# EAGLE design pomodoro_pcb (EAGLE 9.6.2)
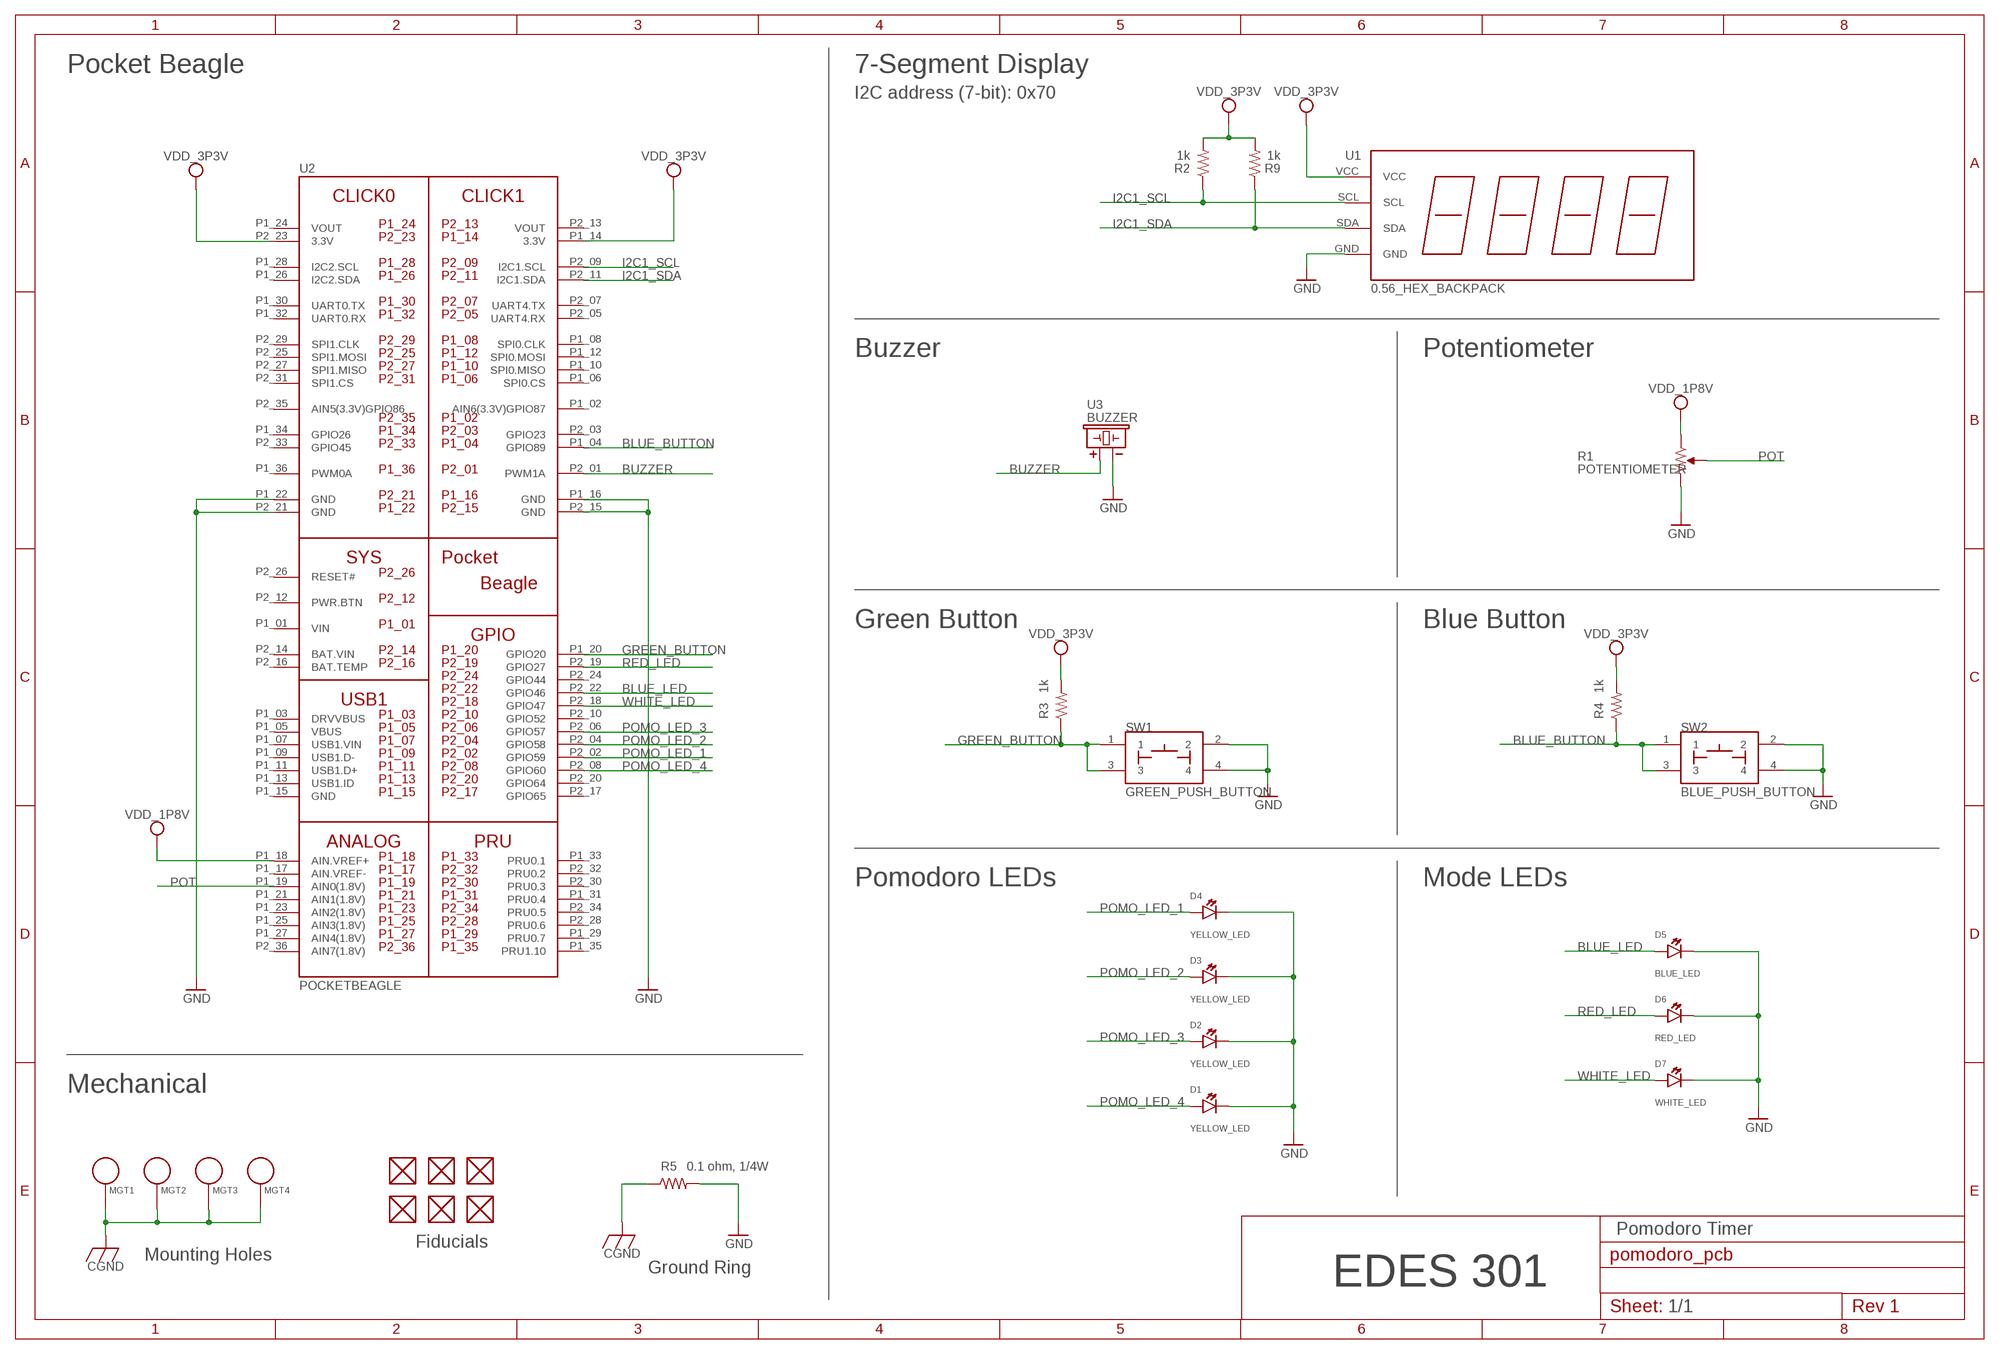
[diagram p0: schematic, sheet 1]

## Parts
D1  YELLOW_LED  LED  [EIA-STD]
D2  YELLOW_LED  LED  [EIA-STD]
D3  YELLOW_LED  LED  [EIA-STD]
D4  YELLOW_LED  LED  [EIA-STD]
D5  BLUE_LED  LED  [EIA-STD]
D6  RED_LED  LED  [EIA-STD]
D7  WHITE_LED  LED  [EIA-STD]
FUD1  FIDUCIAL  [FIDUCIAL_40MIL]
FUD2  FIDUCIAL  [FIDUCIAL_40MIL]
FUD3  FIDUCIAL  [FIDUCIAL_40MIL]
FUD4  FIDUCIAL  [FIDUCIAL_40MIL]
FUD5  FIDUCIAL  [FIDUCIAL_40MIL]
FUD6  FIDUCIAL  [FIDUCIAL_40MIL]
MGT1  MOUNTING_HOLE  [MOUNTING_HOLE]
MGT2  MOUNTING_HOLE  [MOUNTING_HOLE]
MGT3  MOUNTING_HOLE  [MOUNTING_HOLE]
MGT4  MOUNTING_HOLE  [MOUNTING_HOLE]
R1  POTENTIOMETER  [POT-PO90S]
R2  1k  R_R0603  [R0603]
R3  1k  R_R0603  [R0603]
R4  1k  R_R0603  [R0603]
R5  0.1 ohm, 1/4W  R_R0603  [R0603]
R9  1k  R_R0603  [R0603]
SW1  GREEN_PUSH_BUTTON  PUSH_BUTTON  [BUTTON_12.5MM]
SW2  BLUE_PUSH_BUTTON  PUSH_BUTTON  [BUTTON_12.5MM]
U1  0.56_HEX_BACKPACK  [0.56_HEX_BACKPACK]
U2  POCKETBEAGLE  [POCKETBEAGLE]
U3  BUZZER  [BUZZER_6.5MM]

## Nets
BLUE_BUTTON: R4.1 SW2.1 SW2.3 U2.P1_04(GPIO89)
BLUE_LED: D5.ANODE U2.P2_22(GPIO46)
BUZZER: U2.P2_01(PWM1A) U3.+
CGND: MGT1.P$1 MGT2.P$1 MGT3.P$1 MGT4.P$1 R5.1
GND: D1.CATHODE D2.CATHODE D3.CATHODE D4.CATHODE D5.CATHODE D6.CATHODE D7.CATHODE R1.CW R5.2 SW1.2 SW1.4 SW2.2 SW2.4 U1.GND U2.P1_16(GND) U2.P1_22(GND) U2.P2_15(GND) U2.P2_21(GND) U3.-
GREEN_BUTTON: R3.1 SW1.1 SW1.3 U2.P1_20(GPIO20)
I2C1_SCL: R2.1 U1.SCL U2.P2_09(I2C1.SCL)
I2C1_SDA: R9.1 U1.SDA U2.P2_11(I2C1.SDA)
POMO_LED_1: D4.ANODE U2.P2_02(GPIO59)
POMO_LED_2: D3.ANODE U2.P2_04(GPIO58)
POMO_LED_3: D2.ANODE U2.P2_06(GPIO57)
POMO_LED_4: D1.ANODE U2.P2_08(GPIO60)
POT: R1.S U2.P1_19(AIN0(1.8V))
RED_LED: D6.ANODE U2.P2_19(GPIO27)
VDD_1P8V: R1.CCW U2.P1_18(AIN.VREF+)
VDD_3P3V: R2.2 R3.2 R4.2 R9.2 U1.VCC U2.P1_14(3.3V) U2.P2_23(3.3V)
WHITE_LED: D7.ANODE U2.P2_18(GPIO47)
Unconnected: FUD1.P$1 FUD2.P$1 FUD3.P$1 FUD4.P$1 FUD5.P$1 FUD6.P$1 U2.P1_02(AIN6(3.3V)GPIO87) U2.P1_03(DRVVBUS) U2.P1_05(VBUS) U2.P1_06(SPI0.CS) U2.P1_07(USB1.VIN) U2.P1_08(SPI0.CLK) U2.P1_09(USB1.D-) U2.P1_10(SPI0.MISO) U2.P1_11(USB1.D+) U2.P1_12(SPI0.MOSI) U2.P1_13(USB1.ID) U2.P1_15(GND) U2.P1_17(AIN.VREF-) U2.P1_21(AIN1(1.8V)) U2.P1_23(AIN2(1.8V)) U2.P1_25(AIN3(1.8V)) U2.P1_26(I2C2.SDA) U2.P1_27(AIN4(1.8V)) U2.P1_28(I2C2.SCL) U2.P1_29(PRU0.7) U2.P1_30(UART0.TX) U2.P1_31(PRU0.4) U2.P1_32(UART0.RX) U2.P1_33(PRU0.1) U2.P1_34(GPIO26) U2.P1_35(PRU1.10) U2.P1_36(PWM0A) U2.P2_03(GPIO23) U2.P2_05(UART4.RX) U2.P2_07(UART4.TX) U2.P2_10(GPIO52) U2.P2_12(PWR.BTN) U2.P2_16(BAT.TEMP) U2.P2_17(GPIO65) U2.P2_20(GPIO64) U2.P2_24(GPIO44) U2.P2_25(SPI1.MOSI) U2.P2_26(RESET#) U2.P2_27(SPI1.MISO) U2.P2_28(PRU0.6) U2.P2_29(SPI1.CLK) U2.P2_30(PRU0.3) U2.P2_31(SPI1.CS) U2.P2_32(PRU0.2) U2.P2_33(GPIO45) U2.P2_34(PRU0.5) U2.P2_35(AIN5(3.3V)GPIO86) U2.P2_36(AIN7(1.8V))

## Notes on the sheet
- Pocket Beagle | 7-Segment Display
- I2C address (7-bit): 0x70
- Buzzer | Potentiometer
- Green Button | Blue Button
- Pomodoro LEDs | Mode LEDs
- Mechanical
- Pomodoro Timer
- Fiducials
- Mounting Holes
- Ground Ring
- EDES 301
- 1/1

## Power pins joined to a net without a drawn wire
BAT.VIN: U2.P2_14(BAT.VIN)
VIN: U2.P1_01(VIN)
VOUT: U2.P1_24(VOUT) U2.P2_13(VOUT)

## Library data of the parts
D1-D7 = pomodoro_timer:LED: EIA-STD LED, LTST-C191TBKT
FUD1-FUD6 = pomodoro_timer:FIDUCIAL
MGT1-MGT4 = pomodoro_timer:MOUNTING_HOLE: Chassis Mounting Hole w/GND connection ability
R1 = pomodoro_timer:POTENTIOMETER: Potentiometer - Examples: P090S-14T20BR10K (987-1277-ND)
R2-R5 R9 = pomodoro_timer:R_: RESISTOR, American symbol
SW1 SW2 = pomodoro_timer:PUSH_BUTTON
U1 = pomodoro_timer:0.56_HEX_BACKPACK: 0.56" LED HEX Backback - Adafruit HT16K33 - https://www.adafruit.com/product/878 - https://www.adafruit.com/product/879 - https://www.adafruit.com/product/880 - https://www.adafruit.com/product/881 - https://www.adafruit.com/product/1002
U2 = pomodoro_timer:POCKETBEAGLE
U3 = pomodoro_timer:BUZZER: CEM-1203 Buzzer

## Board
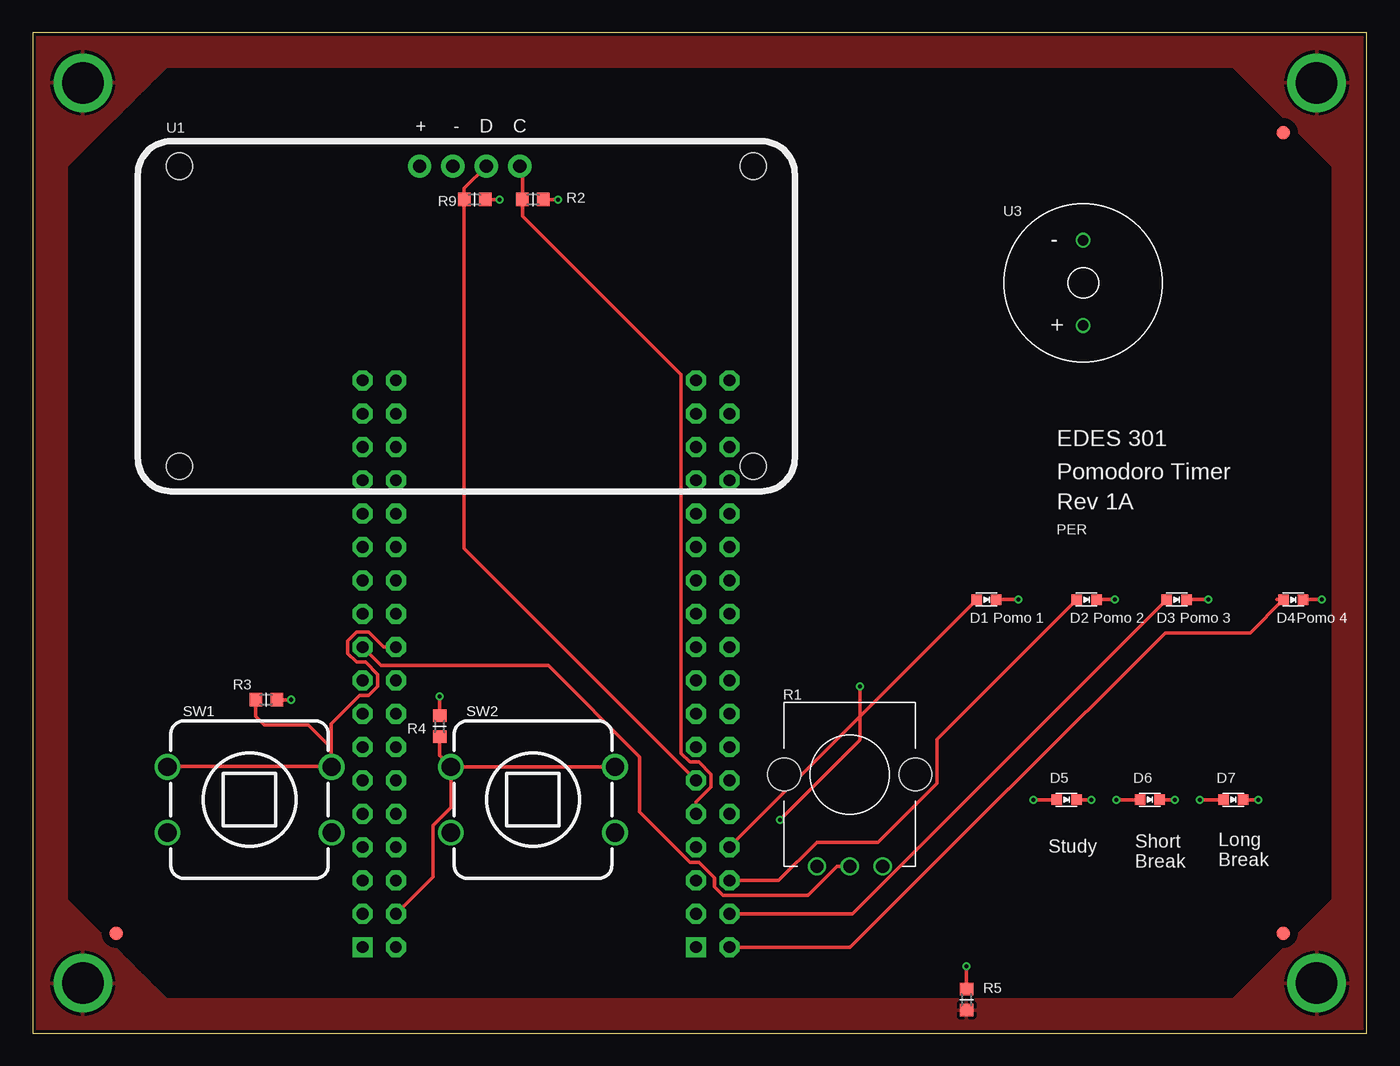
[diagram p1: board, top side]
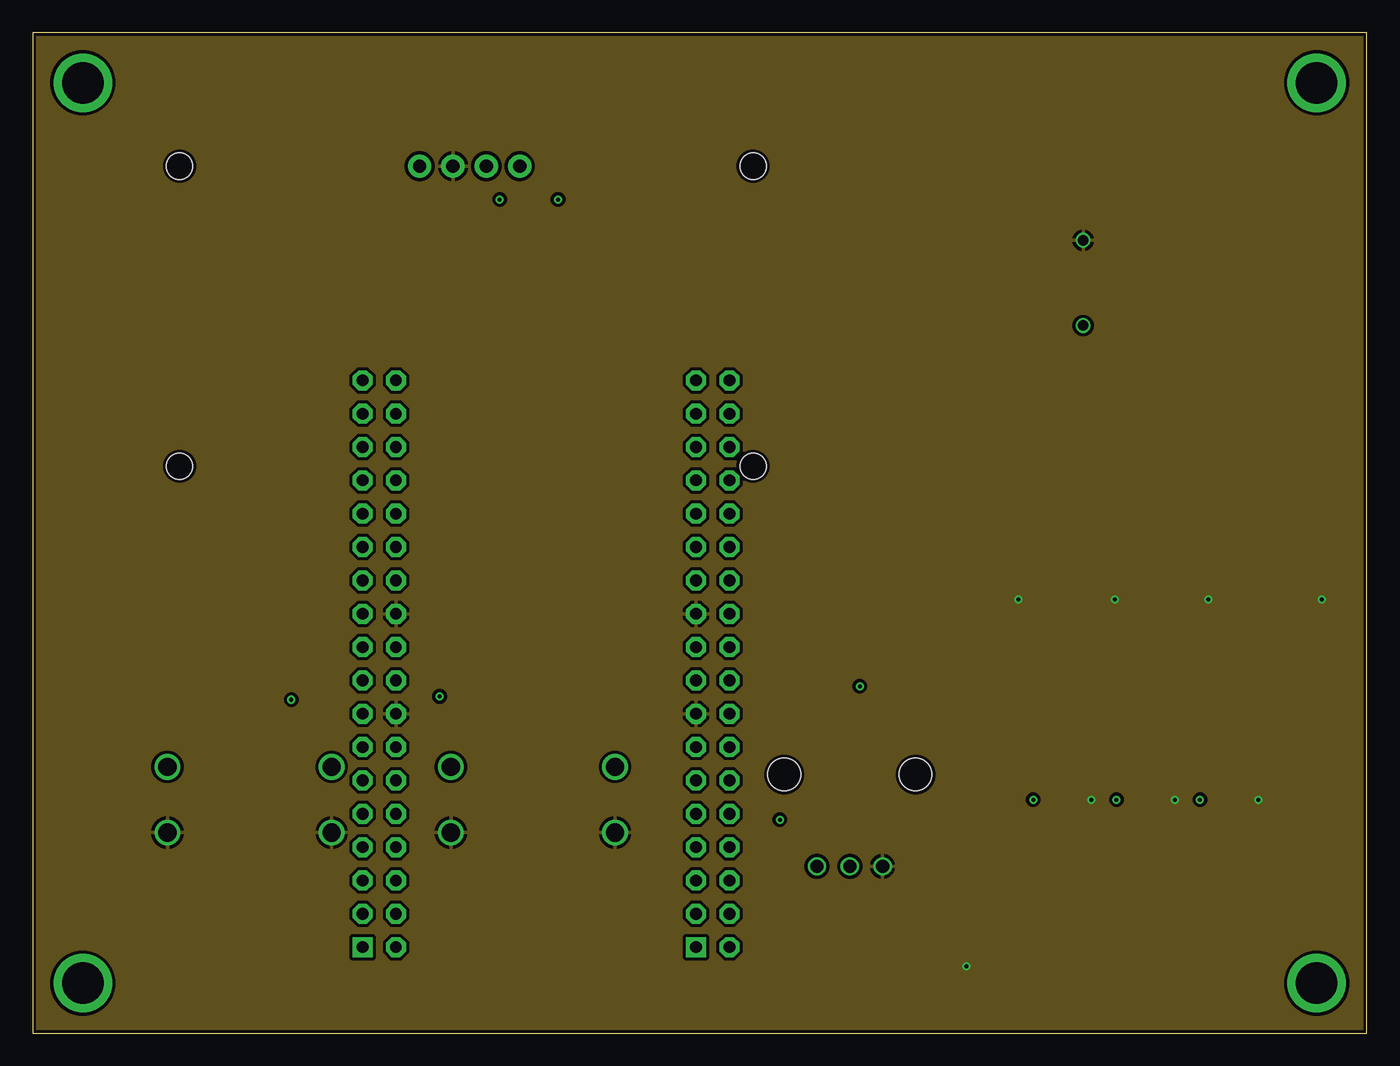
[diagram p2: board, inner layer Route2]
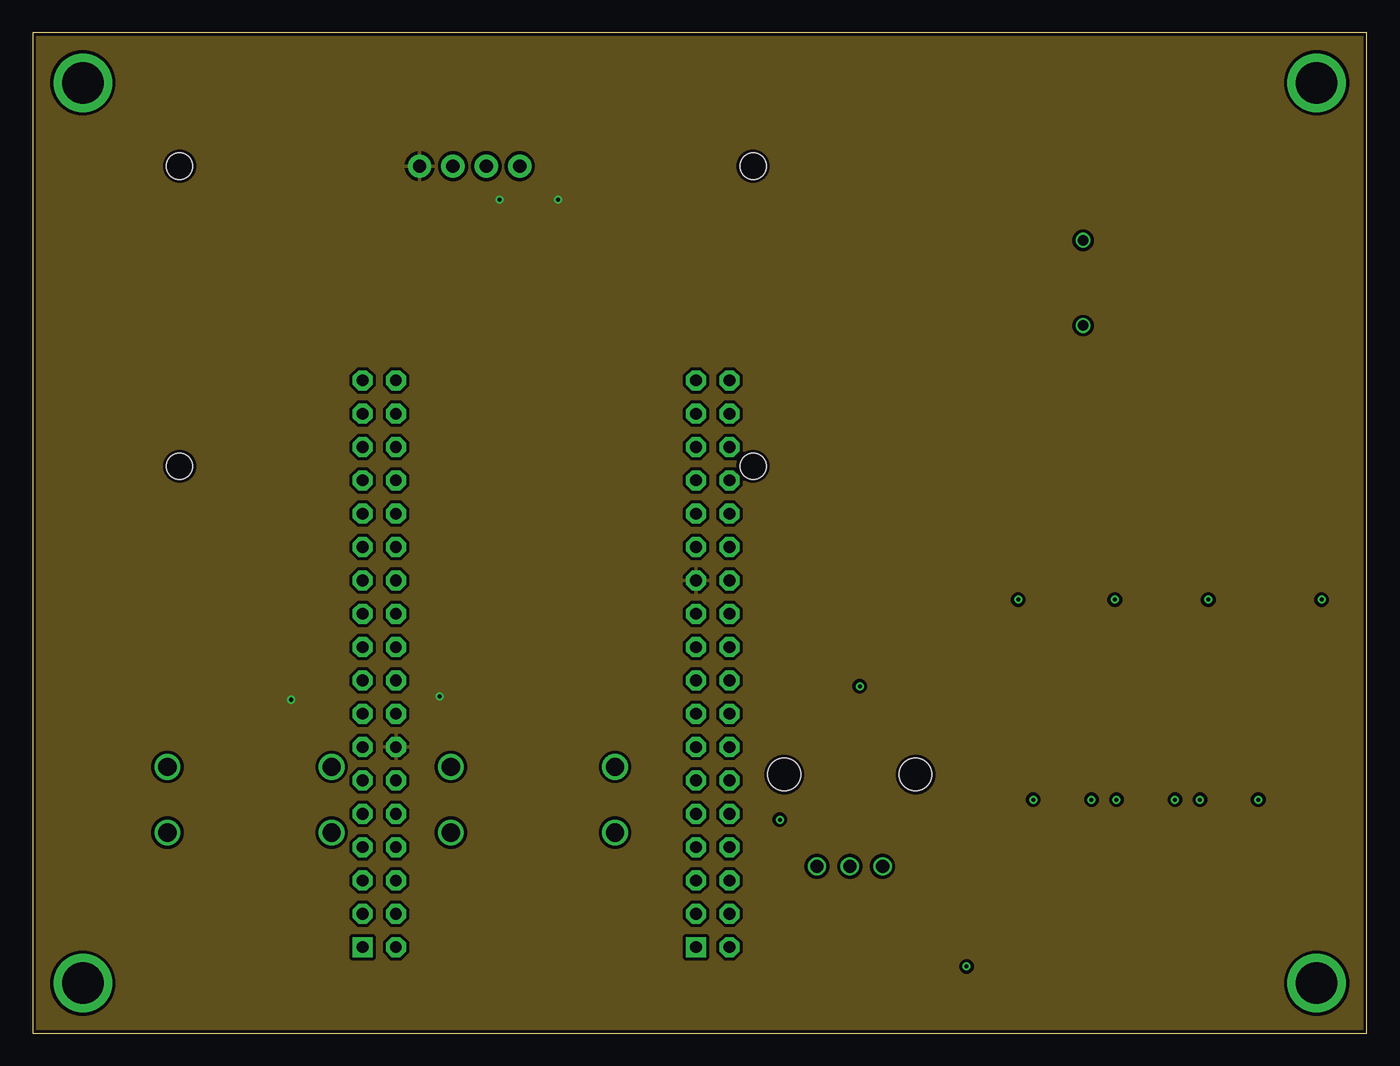
[diagram p3: board, inner layer Route15]
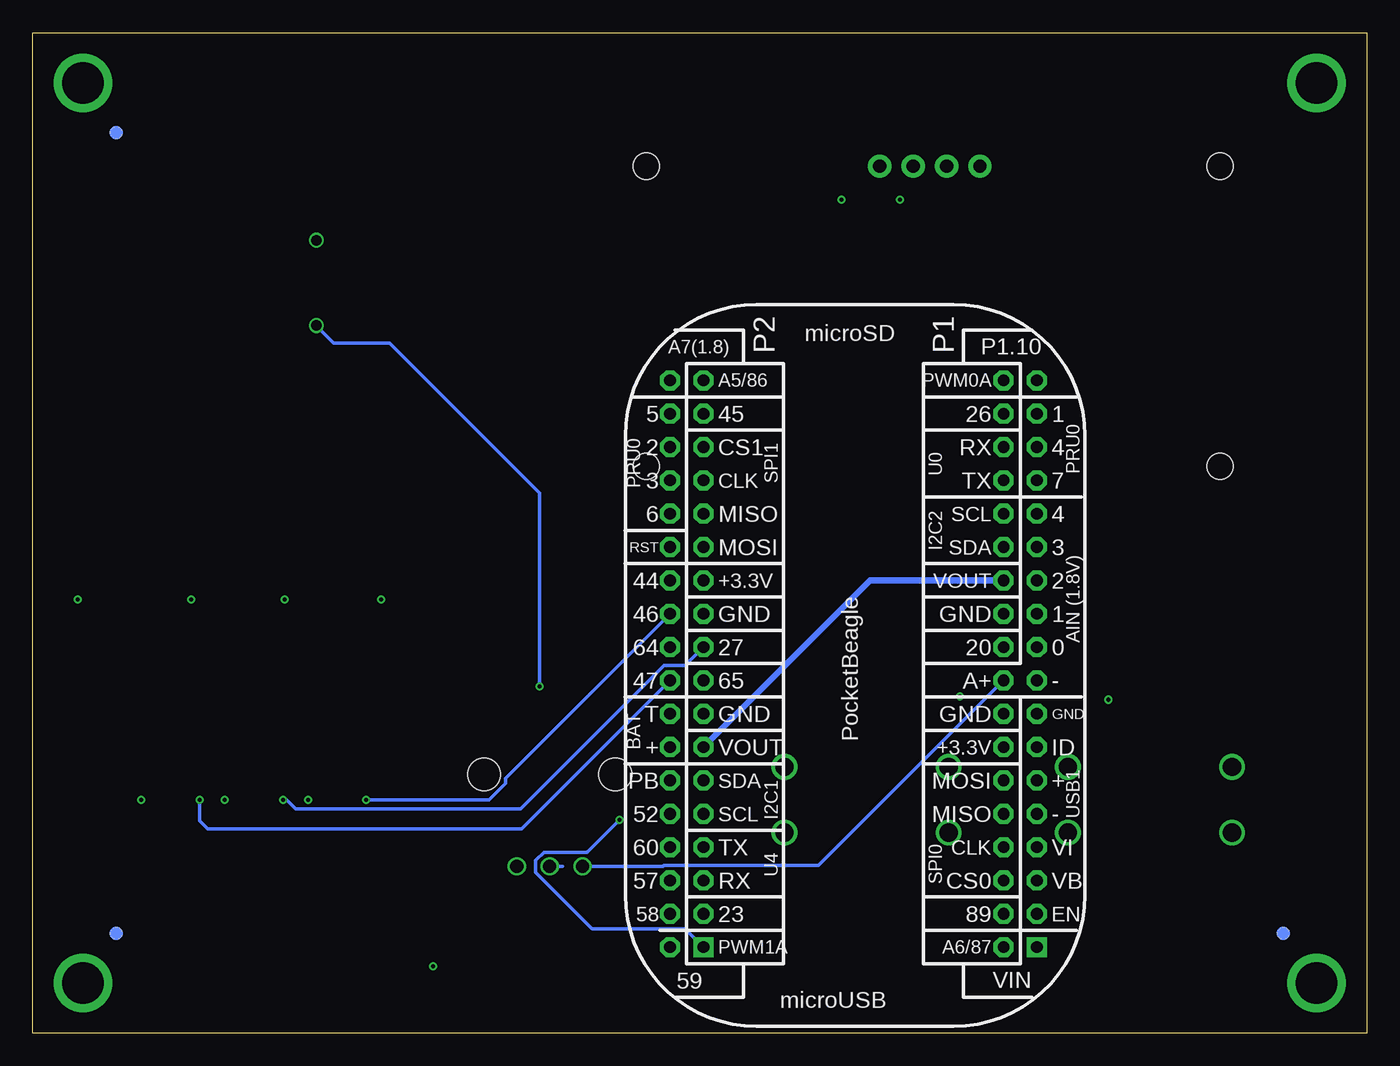
[diagram p4: board, bottom side, seen from below]

Size 101.6 x 76.2 mm. Coordinates in mm from the lower left corner, seen from the top.
Outline: 0,0 101.6,0 101.6,76.2 0,76.2 0,0
Copper layers (1*2*15*16): Top 0.035mm / dielectric 0.23mm / Route2 0.035mm / dielectric 0.93mm / Route15 0.035mm / dielectric 0.23mm / Bottom 0.035mm
Design rules "EDES301_4lyr": minimum track width 10mil, minimum drill 12mil, track to track 10mil, track to pad 10mil, pad to pad 10mil, via to via 10mil, smd to smd 10mil, copper to edge 10mil, drill to drill 12mil, minimum pad ring 6mil, minimum via ring 6mil, stop-mask expansion 3mil, vias tented up to drill 25mil, thermal gap 10mil

### Footprints (pad centres in the part's own frame; a part is rotated, then mirrored left to right if it is on the bottom)
EIA-STD = smd 0.8 x 0.8: ANODE -0.75,0; CATHODE 0.75,0
FIDUCIAL_40MIL = smd 1.016 x 1.016: P$1 0,0
MOUNTING_HOLE = drill 3.175 pad 4.445: P$1 0,0
POT-PO90S = drill 1: CCW -2.5,0; CW 2.5,0; S 0,0 | hole 2.5: -5,7; 5,7
R0603 = smd 0.95 x 1.031: 1 -0.8,0; 2 0.8,0
BUTTON_12.5MM = drill 1.4: 1 -6.25,2.5; 2 -6.25,-2.5; 3 6.25,2.5; 4 6.25,-2.5
0.56_HEX_BACKPACK = drill 1.016 pad 1.778: GND -1.016,11.43; SCL 4.064,11.43; SDA 1.524,11.43; VCC -3.556,11.43 | hole 2: -21.844,-11.43; 21.844,-11.43; -21.844,11.43; 21.844,11.43
POCKETBEAGLE = drill 0.889 pad 1.524 square: P1_01 5.91,3.53; P2_01 5.91,28.93 | drill 0.889 pad 1.524 octagon: P1_02 5.91,6.07; P1_03 8.45,3.53; P1_04 8.45,6.07; P1_05 10.99,3.53; P1_06 10.99,6.07; P1_07 13.53,3.53; P1_08 13.53,6.07; P1_09 16.07,3.53; P1_10 16.07,6.07; P1_11 18.61,3.53; P1_12 18.61,6.07; P1_13 21.15,3.53; P1_14 21.15,6.07; P1_15 23.69,3.53; P1_16 23.69,6.07; P1_17 26.23,3.53; P1_18 26.23,6.07; P1_19 28.77,3.53; P1_20 28.77,6.07; P1_21 31.31,3.53; P1_22 31.31,6.07; P1_23 33.85,3.53; P1_24 33.85,6.07; P1_25 36.39,3.53; P1_26 36.39,6.07; P1_27 38.93,3.53; P1_28 38.93,6.07; P1_29 41.47,3.53; P1_30 41.47,6.07; P1_31 44.01,3.53; P1_32 44.01,6.07; P1_33 46.55,3.53; P1_34 46.55,6.07; P1_35 49.09,3.53; P1_36 49.09,6.07; P2_02 5.91,31.47; P2_03 8.45,28.93; P2_04 8.45,31.47; P2_05 10.99,28.93; P2_06 10.99,31.47; P2_07 13.53,28.93; P2_08 13.53,31.47; P2_09 16.07,28.93; P2_10 16.07,31.47; P2_11 18.61,28.93; P2_12 18.61,31.47; P2_13 21.15,28.93; P2_14 21.15,31.47; P2_15 23.69,28.93; P2_16 23.69,31.47; P2_17 26.23,28.93; P2_18 26.23,31.47; P2_19 28.77,28.93; P2_20 28.77,31.47; P2_21 31.31,28.93; P2_22 31.31,31.47; P2_23 33.85,28.93; P2_24 33.85,31.47; P2_25 36.39,28.93; P2_26 36.39,31.47; P2_27 38.93,28.93; P2_28 38.93,31.47; P2_29 41.47,28.93; P2_30 41.47,31.47; P2_31 44.01,28.93; P2_32 44.01,31.47; P2_33 46.55,28.93; P2_34 46.55,31.47; P2_35 49.09,28.93; P2_36 49.09,31.47
BUZZER_6.5MM = drill 0.8: + 0,-3.25; - 0,3.25

### Placement (x,y rotation side)
D1  72.64,33.02 0 top
D2  80.26,33.02 0 top
D3  87.12,33.02 0 top
D4  96.01,33.02 0 top
D5  78.74,17.78 0 top
D6  85.09,17.78 0 top
D7  91.44,17.78 0 top
FUD1  6.35,7.62 0 bottom
FUD2  95.25,68.58 0 top
FUD3  95.25,7.62 0 top
FUD4  95.25,68.58 0 bottom
FUD5  95.25,7.62 0 bottom
FUD6  6.35,7.62 0 top
MGT1  3.81,3.81 0 top
MGT2  3.81,72.39 0 top
MGT3  97.79,72.39 0 top
MGT4  97.79,3.81 0 top
R1  62.23,12.7 0 top
R2  38.1,63.5 0 top
R3  17.78,25.4 0 top
R4  30.99,23.37 90 top
R5  71.12,2.54 90 top
R9  33.66,63.5 0 top
SW1  16.51,17.78 0 top
SW2  38.1,17.78 0 top
U1  33.02,54.61 0 top
U2  21.59,0.64 90 bottom
U3  80.01,57.15 0 top

### Tracks (layer width: path | path; a pad name or v marks a point on that pad's centre or on a via)
BLUE_BUTTON
  Top 0.254: SW2.1 SW2.3 | SW2.1 30.99,21.14 R4.1 | SW2.1 31.85,17.2 30.49,15.84 30.49,11.91 U2.P1_04
BLUE_LED  (via drill 0.3 pad 0.61)
  Top 0.254: D5.ANODE v76.2,17.78
  Bottom 0.254: U2.P2_22 65.6,19.41 65.6,19.02 66.84,17.78 v76.2,17.78
BUZZER  (via drill 0.3 pad 0.61)
  Top 0.254: v62.99,26.42 62.99,22.35 v56.9,16.26
  Bottom 0.254: U3.+ 78.69,52.58 74.42,52.58 62.99,41.15 v62.99,26.42 | U2.P2_01 51.92,7.94 59,7.94 63.31,12.25 63.31,13.15 62.68,13.78 59.37,13.78 v56.9,16.26
CGND
  pour Top: -2.54,35.56 2.54,35.56 2.54,10.16 10.16,2.54 91.44,2.54 99.06,10.16 99.06,35.56 104.14,35.56 104.14,-2.54 -2.54,-2.54
  pour Top: -2.54,35.56 -2.54,78.74 104.14,78.74 104.14,35.56 99.06,35.56 99.06,66.04 91.44,73.66 10.16,73.66 2.54,66.04 2.54,35.56
GND  (via drill 0.3 pad 0.61)
  Top 0.254: D1.CATHODE v75.06,33.02 | D2.CATHODE v82.42,33.02 | D3.CATHODE v89.53,33.02 | D4.CATHODE v98.17,33.02 | v71.12,5.08 R5.2 | D5.CATHODE v80.64,17.78 | D6.CATHODE v87,17.78 | D7.CATHODE v93.34,17.78
  pour Route2: -5.08,81.28 106.68,81.28 106.68,-5.08 -5.08,-5.08
GREEN_BUTTON
  Top 0.254: SW1.1 10.3,20.32 22.72,20.32 | 22.72,20.32 SW1.3 | R3.1 16.98,24.13 17.61,23.5 20.95,23.5 22.72,21.73 | 22.72,21.73 22.72,20.32 | 22.72,21.73 22.72,23.54 24.9,25.72 25.59,25.72 26.26,26.39 26.26,27.34 25.34,28.26 24.65,28.26 23.98,28.93 23.98,29.88 24.65,30.55 25.59,30.55 26.74,29.41 U2.P1_20
I2C1_SCL
  Top 0.254: U1.SCL 37.3,65.82 R2.1 37.3,62.23 49.38,50.15 49.38,21.31 50.05,20.64 50.74,20.64 51.66,19.72 51.66,18.77 50.52,17.63 U2.P2_09
I2C1_SDA
  Top 0.254: U1.SDA 32.85,64.35 R9.1 32.85,36.91 U2.P2_11
POMO_LED_1
  Top 0.254: 94.75,33.02 D4.ANODE 92.72,30.48 86.25,30.48 74.33,18.56 74.26,18.56 62.24,6.54 U2.P2_02
POMO_LED_2
  Top 0.254: D3.ANODE 62.44,9.09 U2.P2_04
POMO_LED_3
  Top 0.254: D2.ANODE 68.86,22.37 68.86,19.02 64.38,14.55 59.71,14.55 56.79,11.62 U2.P2_06
POMO_LED_4
  Top 0.254: U2.P2_08 53.06,14.19 D1.ANODE
POT
  Top 0.254: U2.P1_19 26.52,28.01 39.27,28.01 46.22,21.05 46.22,16.85 50.05,13.02 50.74,13.02 51.92,11.84 51.92,11.15 52.59,10.48 59.04,10.48 61.26,12.7 R1.S
  Bottom 0.254: R1.S 61.26,12.7
RED_LED  (via drill 0.3 pad 0.61)
  Top 0.254: D6.ANODE v82.55,17.78
  Bottom 0.254: U2.P2_19 51.92,28.01 53.53,28.01 64.45,17.09 81.56,17.09 82.25,17.78 v82.55,17.78
VDD_1P8V
  Bottom 0.254: R1.CCW 53.6,12.7 53.53,12.77 41.76,12.77 U2.P1_18
VDD_3P3V  (via drill 0.3 pad 0.61)
  Top 0.254: R3.2 v19.68,25.4 | R9.2 v35.56,63.5 | R2.2 v40.01,63.5 | R4.2 v30.99,25.65
  pour Route15: -7.62,-7.62 -7.62,83.82 109.22,83.82 109.22,-7.62
VOUT
  Bottom 0.508: U2.P1_24 37.82,34.48 U2.P2_13
WHITE_LED  (via drill 0.3 pad 0.61)
  Top 0.254: D7.ANODE v88.9,17.78
  Bottom 0.254: v88.9,17.78 88.9,16.18 88.3,15.57 64.36,15.57 U2.P2_18

### Text on the board
tPlace: EDES 301 | Pomodoro Timer | Rev 1A | PER | Pomo 1 | Pomo 2 | Pomo 3 | Pomo 4 | Study | Short / Break | Long / Break